# Altium project science-board-25.PrjPcb
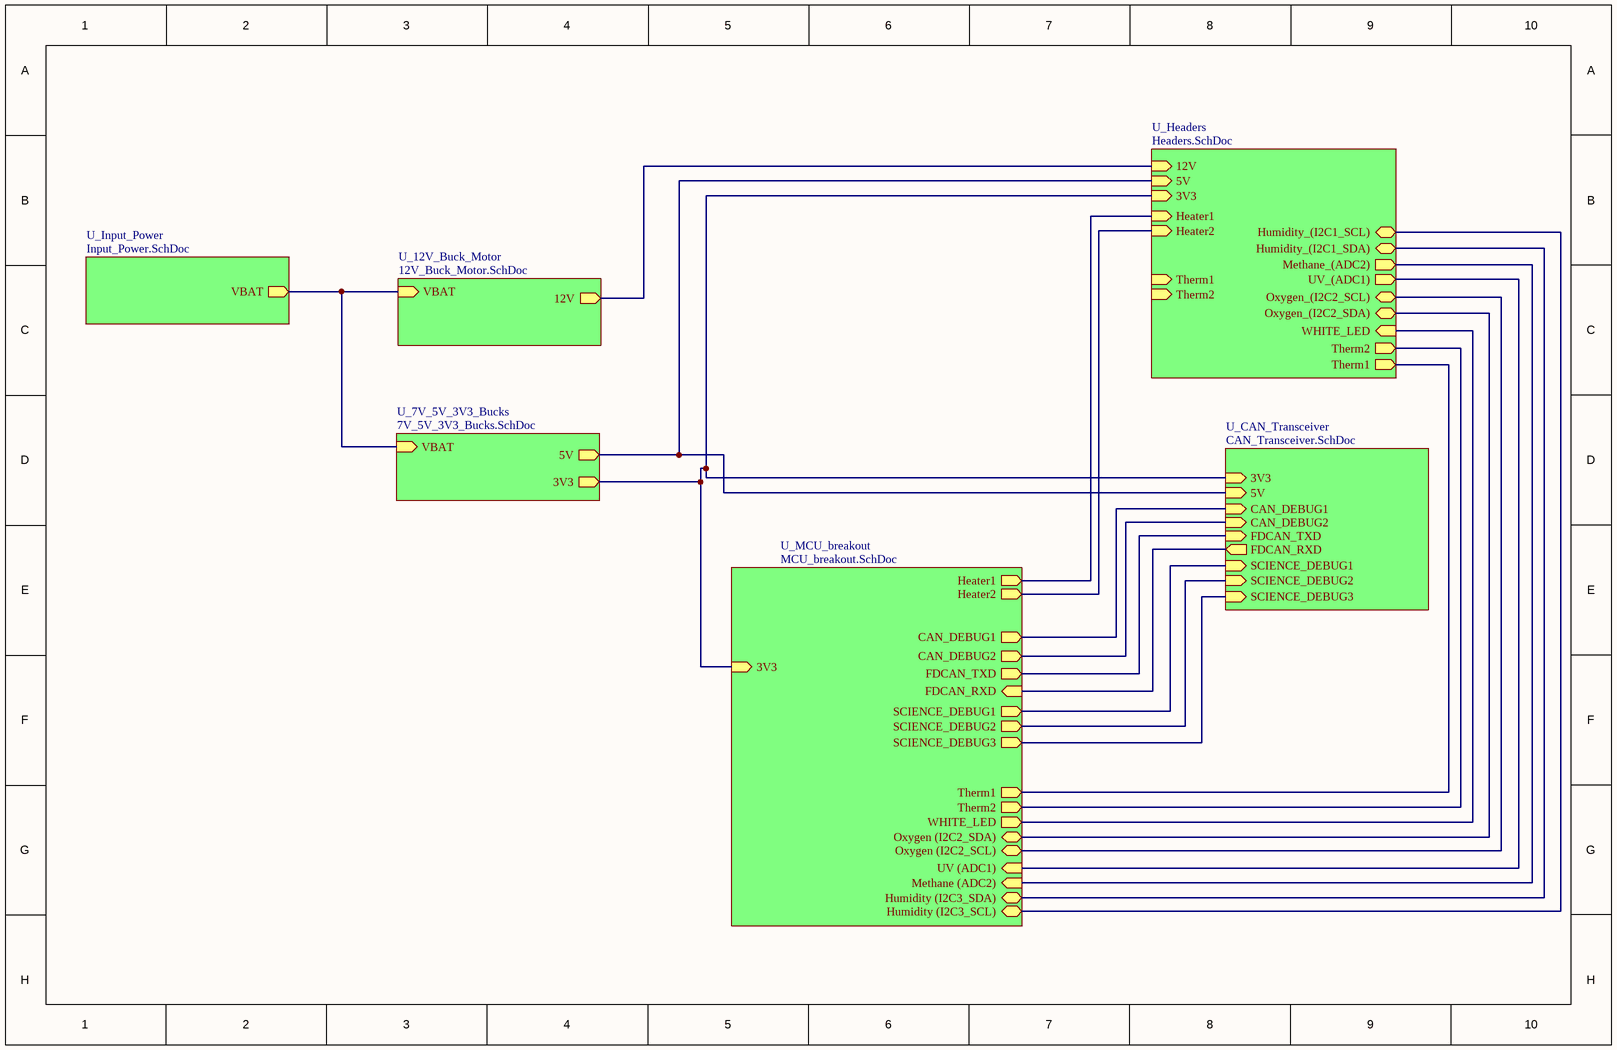
[diagram p0: TLD.SchDoc]
7 sheets, 135 parts. Net scope: hierarchical (ports join the sheet entries above them; power ports are global).
Board file: science_board_25.PcbDoc
Sheets:
  TLD.SchDoc
    U_12V_Buck_Motor = 12V_Buck_Motor.SchDoc
    U_CAN_Transceiver = CAN_Transceiver.SchDoc
    U_7V_5V_3V3_Bucks = 7V_5V_3V3_Bucks.SchDoc
    U_Headers = Headers.SchDoc
    U_MCU_breakout = MCU_breakout.SchDoc
    U_Input_Power = Input_Power.SchDoc

## Sheet TLD.SchDoc
size 302 x 195 mm; SheetNumber: 1; SheetTotal: 7

### Sub-sheets
U_7V_5V_3V3_Bucks = 7V_5V_3V3_Bucks.SchDoc: VBAT (in), 3V3 (out), 5V (out)
U_12V_Buck_Motor = 12V_Buck_Motor.SchDoc: 12V (out), VBAT (in)
U_CAN_Transceiver = CAN_Transceiver.SchDoc: CAN_DEBUG1 (in), CAN_DEBUG2 (in), FDCAN_TXD (in), FDCAN_RXD (out), 3V3 (in), 5V (in), SCIENCE_DEBUG1 (in), SCIENCE_DEBUG2 (in), SCIENCE_DEBUG3 (in)
U_Headers = Headers.SchDoc: Methane_(ADC2) (out), UV_(ADC1) (out), Heater1 (in), Heater2 (in), Therm1 (out), Therm2 (out), 12V (in), 5V (in), 3V3 (in), Therm1 (in), Therm2 (in), WHITE_LED (in), Humidity_(I2C1_SDA) (bidir), Humidity_(I2C1_SCL) (bidir), Oxygen_(I2C2_SCL) (bidir), Oxygen_(I2C2_SDA) (bidir)
U_Input_Power = Input_Power.SchDoc: VBAT (out)
U_MCU_breakout = MCU_breakout.SchDoc: Heater1 (out), Heater2 (out), Therm1 (out), Therm2 (out), CAN_DEBUG1 (out), CAN_DEBUG2 (out), FDCAN_TXD (out), FDCAN_RXD (in), 3V3 (in), Humidity (I2C3_SCL) (bidir), WHITE_LED (out), Oxygen (I2C2_SDA) (bidir), Oxygen (I2C2_SCL) (bidir), UV (ADC1) (in), Methane (ADC2) (in), Humidity (I2C3_SDA) (bidir), SCIENCE_DEBUG3 (out), SCIENCE_DEBUG1 (out), SCIENCE_DEBUG2 (out)

### Nets
3V3_OUT: sheet U_CAN_Transceiver/3V3, sheet U_7V_5V_3V3_Bucks/3V3, sheet U_Headers/3V3, sheet U_MCU_breakout/3V3
5V_OUT: sheet U_CAN_Transceiver/5V, sheet U_7V_5V_3V3_Bucks/5V, sheet U_Headers/5V
VBAT_12V: sheet U_12V_Buck_Motor/VBAT, sheet U_7V_5V_3V3_Bucks/VBAT, sheet U_Input_Power/VBAT
CAN_DEBUG1: sheet U_CAN_Transceiver/CAN_DEBUG1, sheet U_MCU_breakout/CAN_DEBUG1
CAN_DEBUG2: sheet U_CAN_Transceiver/CAN_DEBUG2, sheet U_MCU_breakout/CAN_DEBUG2
FDCAN_RXD: sheet U_CAN_Transceiver/FDCAN_RXD, sheet U_MCU_breakout/FDCAN_RXD
FDCAN_TXD: sheet U_CAN_Transceiver/FDCAN_TXD, sheet U_MCU_breakout/FDCAN_TXD
Heater1: sheet U_Headers/Heater1, sheet U_MCU_breakout/Heater1
Heater2: sheet U_Headers/Heater2, sheet U_MCU_breakout/Heater2
Humidity (I2C3_SCL): sheet U_Headers/Humidity_(I2C1_SCL), sheet U_MCU_breakout/Humidity (I2C3_SCL)
Humidity_SDA: sheet U_Headers/Humidity_(I2C1_SDA), sheet U_MCU_breakout/Humidity (I2C3_SDA)
Methane (ADC2): sheet U_Headers/Methane_(ADC2), sheet U_MCU_breakout/Methane (ADC2)
Oxygen (I2C2_SCL): sheet U_Headers/Oxygen_(I2C2_SCL), sheet U_MCU_breakout/Oxygen (I2C2_SCL)
Oxygen (I2C2_SDA): sheet U_Headers/Oxygen_(I2C2_SDA), sheet U_MCU_breakout/Oxygen (I2C2_SDA)
SCIENCE_DEBUG1: sheet U_CAN_Transceiver/SCIENCE_DEBUG1, sheet U_MCU_breakout/SCIENCE_DEBUG1
SCIENCE_DEBUG2: sheet U_CAN_Transceiver/SCIENCE_DEBUG2, sheet U_MCU_breakout/SCIENCE_DEBUG2
SCIENCE_DEBUG3: sheet U_CAN_Transceiver/SCIENCE_DEBUG3, sheet U_MCU_breakout/SCIENCE_DEBUG3
Therm1: sheet U_Headers/Therm1, sheet U_Headers/Therm1, sheet U_MCU_breakout/Therm1
Therm1: sheet U_Headers/Therm2, sheet U_Headers/Therm2, sheet U_MCU_breakout/Therm2  [a separate net that carries the same name]
UV (ADC1): sheet U_Headers/UV_(ADC1), sheet U_MCU_breakout/UV (ADC1)
WHITE_LED: sheet U_Headers/WHITE_LED, sheet U_MCU_breakout/WHITE_LED
(unnamed): sheet U_12V_Buck_Motor/12V, sheet U_Headers/12V

### Notes on the sheet
- DWG. NO.
- REV.
- SHT.
- REVISION
- DESCRIPTION
- DATE
- APPROVED
- THIS DOCUMENT AND THE DATA DISCLOSED HEREIN OR HEREWITH IS THE PROPERTY OF ALTIUM LIMITED AND MAY BE FREELY DISTRIBUTED IN WHOLE. NO RIGHTS ARE RESERVED OR EXPRESS OR IMPLIED WARANTEE GIVEN.
- ENG:
- DSN:
- APPROVALS
- PROJECT
- DOCUMENT REVISION:
- DESIGN ITEM:
- CHK:
- BOM:
- REFERENCE DOCUMENTS
- PROJECT REVISION:
- TITLE
- FAB DWG:
- PCB DWG:
- ASSY DWG:
- SCALE:
- SIZE
- C
- CAGE CODE
- FILE NAME
- DWG NO.
- SHEET
- OF
- REV

## Sheet 12V_Buck_Motor.SchDoc
size 259 x 167 mm; SheetNumber: 3; SheetTotal: 7
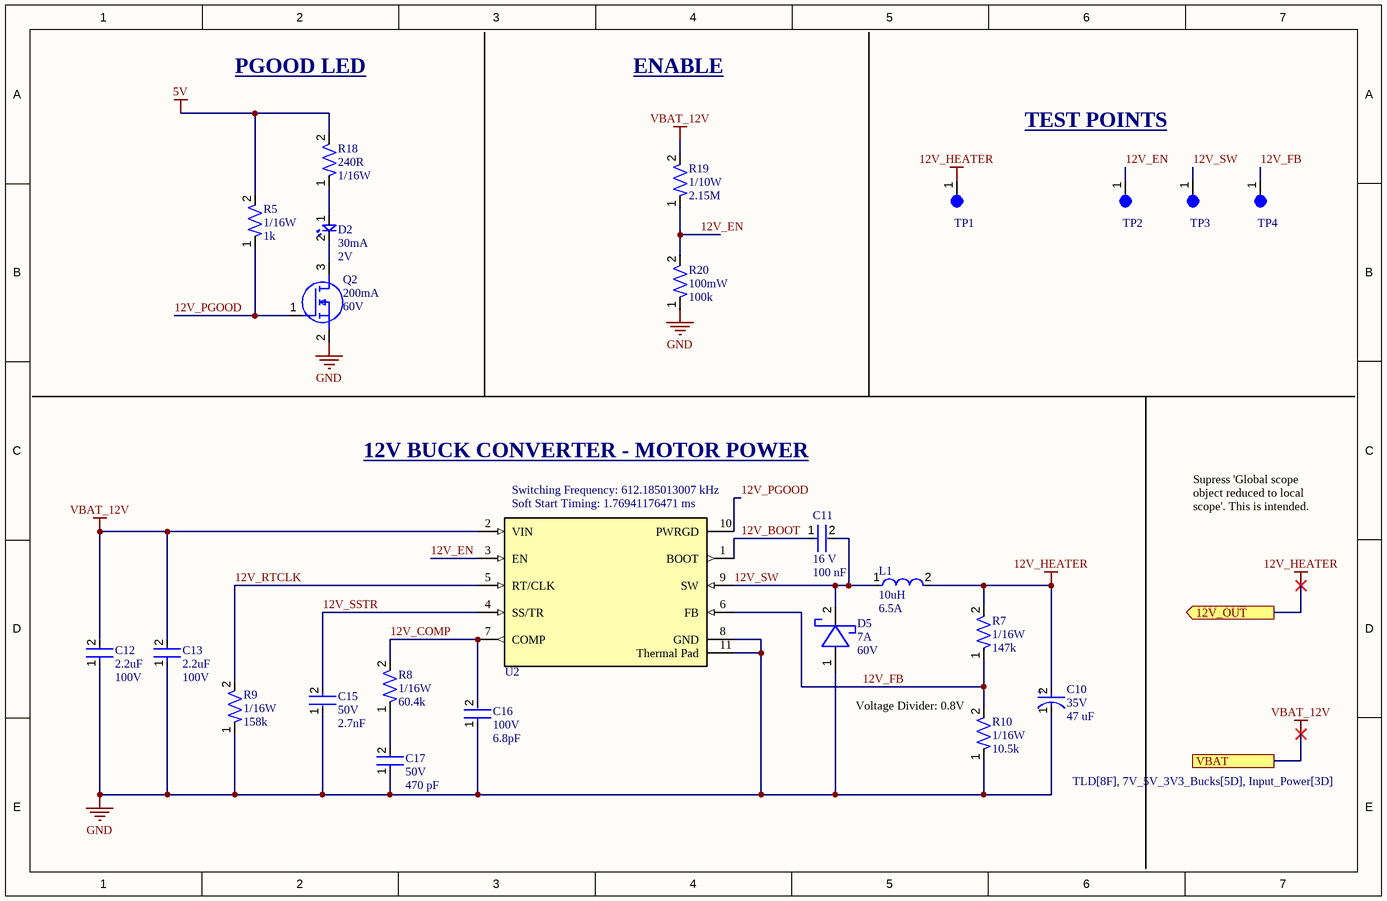
[diagram p1: 12V_Buck_Motor.SchDoc]

### Parts
C10  Voltage: 35V  Capacitance: 47 uF  [CAP-Radial-SMD]  (hidden comment: EEH-ZC1V470P)
C11  Voltage Rating: 16 V  Capacitance: 100 nF  [CAP-0402]  (hidden comment: CC0402KRX7R7BB104)
C12  Capacitance: 2.2uF  Voltage: 100V  [CAP-1206]  (hidden comment: CC1206KKX7R0BB225)
C13  Capacitance: 2.2uF  Voltage: 100V  [CAP-1206]  (hidden comment: CC1206KKX7R0BB225)
C15  Voltage: 50V  Capacitance: 2.7nF  [CAP-0805]  (hidden comment: GRM2165C1H272JA01D)
C16  Voltage: 100V  Capacitance: 6.8pF  [CAP-0603]  (hidden comment: CC0603CRNPO0BN6R8)
C17  Voltage: 50V  Capacitance: 470 pF  [CAP-0805]  (hidden comment: CC0805JRNPO9BN471)
D2  Forward Current: 30mA  Forward Voltage: 2V  [LED-0603]  (hidden comment: BL-HKC36G-AV-TRB)
D5  Forward Current: 7A  Reverse Voltage (DC): 60V  [DO-POWERDI5]  (hidden comment: PDS760-13)
L1  Inductance: 10uH  Current Rating: 6.5A  [IND-10UH-0001]  (hidden comment: BMRF001010401R0MD1)
Q2  Continuous Current: 200mA  Voltage: 60V  [IC-SOT23-3]  (hidden comment: T2N7002AK,LM)
R5  Power: 1/16W  Resistance: 1k  [RES-0402]  (hidden comment: RC0402FR-071KL)
R7  Power: 1/16W  Resistance: 147k  [RES-0402]  (hidden comment: RC0402FR-07147KL)
R8  Power: 1/16W  Resistance: 60.4k  [RES-0402]  (hidden comment: RC0402FR-0760K4L)
R9  Power: 1/16W  Resistance: 158k  [RES-0402]  (hidden comment: RC0402FR-07158KL)
R10  Power: 1/16W  Resistance: 10.5k  [RES-0402]  (hidden comment: RC0402FR-0710K5L)
R18  Resistance: 240R  Power: 1/16W  [RES-0402]  (hidden comment: RC0402FR-07240RL)
R19  Power: 1/10W  Resistance: 2.15M  [RES-0603]  (hidden comment: RC0603FR-072M15L)
R20  Power: 100mW  Resistance: 100k  [RES-0603]  (hidden comment: RC0603FR-07100KL)
TP1  5003  [TEST-POINT-0001]  (value not drawn)
TP2  5003  [TEST-POINT-0001]  (value not drawn)
TP3  5003  [TEST-POINT-0001]  (value not drawn)
TP4  5003  [TEST-POINT-0001]  (value not drawn)
U2  TPS54561DPRR  [IC-10WSON]  (value not drawn)

### Ports
12V_OUT (out), VBAT (see TLD[8F], 7V_5V_3V3_Bucks[5D], Input_Power[3D])

### Nets
5V: R5.2 R18.2  [project net 5V_OUT]
12V_HEATER: C10.2(A) L1.2 R7.2 TP1.1 ; port 12V_OUT
GND: C10.1(C) C12.1 C13.1 C15.1 C16.1 C17.1 D5.1(CATHODE) Q2.2(S) R9.1 R10.1 R20.1 U2.8(GND) U2.11(Thermal_Pad)
VBAT_12V: C12.2 C13.2 R19.2 U2.2(VIN) ; port VBAT
12V_BOOT: C11.1 U2.1(BOOT)
12V_COMP: C16.2 R8.2 U2.7(COMP)
12V_EN: R19.1 R20.2 TP2.1 U2.3(EN)
12V_FB: R7.1 R10.2 TP4.1 U2.6(FB)
12V_PGOOD: Q2.1(G) R5.1 U2.10(PWRGD)
12V_RTCLK: R9.2 U2.5(RT/CLK)
12V_SSTR: C15.2 U2.4(SS/TR)
12V_SW: C11.2 D5.2(ANODE) L1.1 TP3.1 U2.9(SW)
NetC17_2: C17.2 R8.1
NetD2_1: D2.1 R18.1
NetD2_2: D2.2 Q2.3(D)

### Notes on the sheet
- PGOOD LED
- ENABLE
- TEST POINTS
- 12V BUCK CONVERTER - MOTOR POWER
- (near U2) Switching Frequency: 612.185013007 kHz
- (near U2) Soft Start Timing: 1.76941176471 ms
- Supress 'Global scope object reduced to local scope'. This is intended.
- (near R10) Voltage Divider: 0.8V
- DWG. NO.
- REV.
- SHT.
- REVISION
- DESCRIPTION
- DATE
- APPROVED
- THIS DOCUMENT AND THE DATA DISCLOSED HEREIN OR HEREWITH IS THE PROPERTY OF ALTIUM LIMITED AND MAY BE FREELY DISTRIBUTED IN WHOLE. NO RIGHTS ARE RESERVED OR EXPRESS OR IMPLIED WARANTEE GIVEN.
- ENG:
- DSN:
- APPROVALS
- PROJECT
- DOCUMENT REVISION:
- DESIGN ITEM:
- CHK:
- BOM:
- REFERENCE DOCUMENTS
- PROJECT REVISION:
- TITLE
- FAB DWG:
- PCB DWG:
- ASSY DWG:
- SCALE:
- SIZE
- C
- CAGE CODE
- FILE NAME
- DWG NO.
- SHEET
- OF
- REV
- (in symbol CAP-47U-0002) +

### Library data of the parts
C10 = CAP-47U-0002: CAP ALUM HYBRID 47UF 20% 35V SMD; Device Class: Electrolytic; ComponentLink1Description: Datasheet; ComponentLink1URL: https://industrial.panasonic.com/cdbs/www-data/pdf/RDD0000/ABA0000C1234.pdf
C11 = CAP-0.1U-0001: CAP CER 0.1UF 16V X7R 0402; ComponentLink2Description: Datasheet; ComponentLink2URL: https://www.yageo.com/upload/media/product/productsearch/datasheet/mlcc/UPY-GPHC_X7R_6.3V-to-250V_24.pdf; Device Class: Ceramic; Size: 0402
C12 C13 = CAP-2.2U-0001: CAP CER 2.2UF 100V X7R 1206; Device Class: Ceramic; Size: 1206; ComponentLink1Description: Datasheet; ComponentLink1URL: https://www.yageo.com/upload/media/product/productsearch/datasheet/mlcc/UPY-GPHC_X7R_6.3V-to-250V_24.pdf
C15 = CAP-2.7N-0001: CAP CER 2700PF 50V C0G/NP0 0805; ComponentLink1Description: Datasheet; ComponentLink1URL: https://search.murata.co.jp/Ceramy/image/img/A01X/G101/ENG/GRM2165C1H272JA01-01.pdf; Device Class: Ceramic; Size: 0805
C16 = CAP-6.8P-0001: CAP CER 6.8PF 100V C0G/NPO 0603; Device Class: Ceramic; ComponentLink1Description: Datasheet; ComponentLink1URL: https://www.yageo.com/upload/media/product/productsearch/datasheet/mlcc/UPY-GPHC_X7R_6.3V-to-250V_24.pdf; Size: 0603
C17 = CAP-470P-0001: CAP CER 470PF 50V C0G/NPO 0805; Device Class: Ceramic; Size: 0805; ComponentLink1Description: Datasheet; ComponentLink1URL: https://www.yageo.com/upload/media/product/productsearch/datasheet/mlcc/UPY-GP_NP0_16V-to-50V_18.pdf
D2 = LED-0001: LED YELLOW CLEAR 0603 SMD; ComponentLink1Description: Datasheet; ComponentLink1URL: https://www.americanbrightled.com/pdffiles/led-components/smt/BL-HKC36G-AV-TRB.pdf
D5 = DIO-SCHOTTKY-0001: DIODE SCHOTTKY 60V 7A POWERDI5; ComponentLink1Description: Datasheet; ComponentLink1URL: https://www.diodes.com/assets/Datasheets/PDS760.pdf
L1 = IND-10U-0001: FIXED IND 10UH 6.5A 30 MOHM SMD; ComponentLink1Description: Datasheet; ComponentLink1URL: https://productfinder.pulseelectronics.com/api/open/part-attachments/datasheet/BMRF001010401R0MD1
Q2 = NMOS-200MA-0001: MOSFET N-CH 60V 200MA SOT23; ComponentLink1Description: Datasheet; ComponentLink1URL: https://toshiba.semicon-storage.com/info/T2N7002AK_datasheet_en_20150401.pdf?did=29712&prodName=T2N7002AK
R5 = RES-1k-0001: RES 1K OHM 1% 1/16W 0402; Tolerance: 1%; Size: 0402; ComponentLink1Description: Datasheet; ComponentLink1URL: https://www.yageo.com/upload/media/product/products/datasheet/rchip/PYu-RC_Group_51_RoHS_L_12.pdf
R7 = RES-147k-0001: RES 147K OHM 1% 1/16W 0402; Tolerance: 1%; Size: 0402; ComponentLink1Description: Datasheet; ComponentLink1URL: https://www.yageo.com/upload/media/product/products/datasheet/rchip/PYu-RC_Group_51_RoHS_L_12.pdf
R8 = RES-60.4k-0001: RES 60.4K OHM 1% 1/16W 0402; Tolerance: 1%; Size: 0402; ComponentLink1Description: Datasheet; ComponentLink1URL: https://www.yageo.com/upload/media/product/products/datasheet/rchip/PYu-RC_Group_51_RoHS_L_12.pdf
R9 = RES-158k-0001: RES 158K OHM 1% 1/16W 0402; Tolerance: 1%; Size: 0402; ComponentLink1Description: Datasheet; ComponentLink1URL: https://www.yageo.com/upload/media/product/products/datasheet/rchip/PYu-RC_Group_51_RoHS_L_12.pdf
R10 = RES-10.5k-0001: RES 10.5K OHM 1% 1/16W 0402; Tolerance: 1%; Size: 0402; ComponentLink1Description: Datasheet; ComponentLink1URL: https://www.yageo.com/upload/media/product/products/datasheet/rchip/PYu-RC_Group_51_RoHS_L_12.pdf
R18 = RES-240-0001: 240R 0.063W 1% 0402 (1005 Metric)  SMD; Tolerance: 1%; Size: 0402; ComponentLink1Description: Datasheet; ComponentLink1URL: https://www.yageo.com/upload/media/product/products/datasheet/rchip/PYu-RC_Group_51_RoHS_L_12.pdf
R19 = RES-2.15M-0001: RES SMD 2.15M OHM 1% 1/10W 0603; Tolerance: 1%; Size: 0603; ComponentLink1Description: Datasheet; ComponentLink1URL: https://www.yageo.com/upload/media/product/products/datasheet/rchip/PYu-RC_Group_51_RoHS_L_12.pdf
R20 = RES-100k-0001: RES SMD 100K OHM 1% 1/10W 0603; Tolerance: 1%; Size: 0603; ComponentLink1Description: Datasheet; ComponentLink1URL: https://www.yageo.com/upload/media/product/products/datasheet/rchip/PYu-RC_Group_51_RoHS_L_12.pdf
TP1-TP4 = TEST-POINT-0001: Oranange PC Test Point, Miniature Phoisphor Bronze Silver Plating Through Hole Mounting Type
U2 = IC-BUCK-0001: IC REG BUCK ADJ 5A 10WSON; ComponentLink1Description: Datasheet; ComponentLink1URL: https://www.ti.com/general/docs/suppproductinfo.tsp?distId=10&gotoUrl=https%3A%2F%2Fwww.ti.com%2Flit%2Fgpn%2Ftps54561

## Sheet CAN_Transceiver.SchDoc
size 259 x 167 mm; SheetNumber: 5; SheetTotal: 7
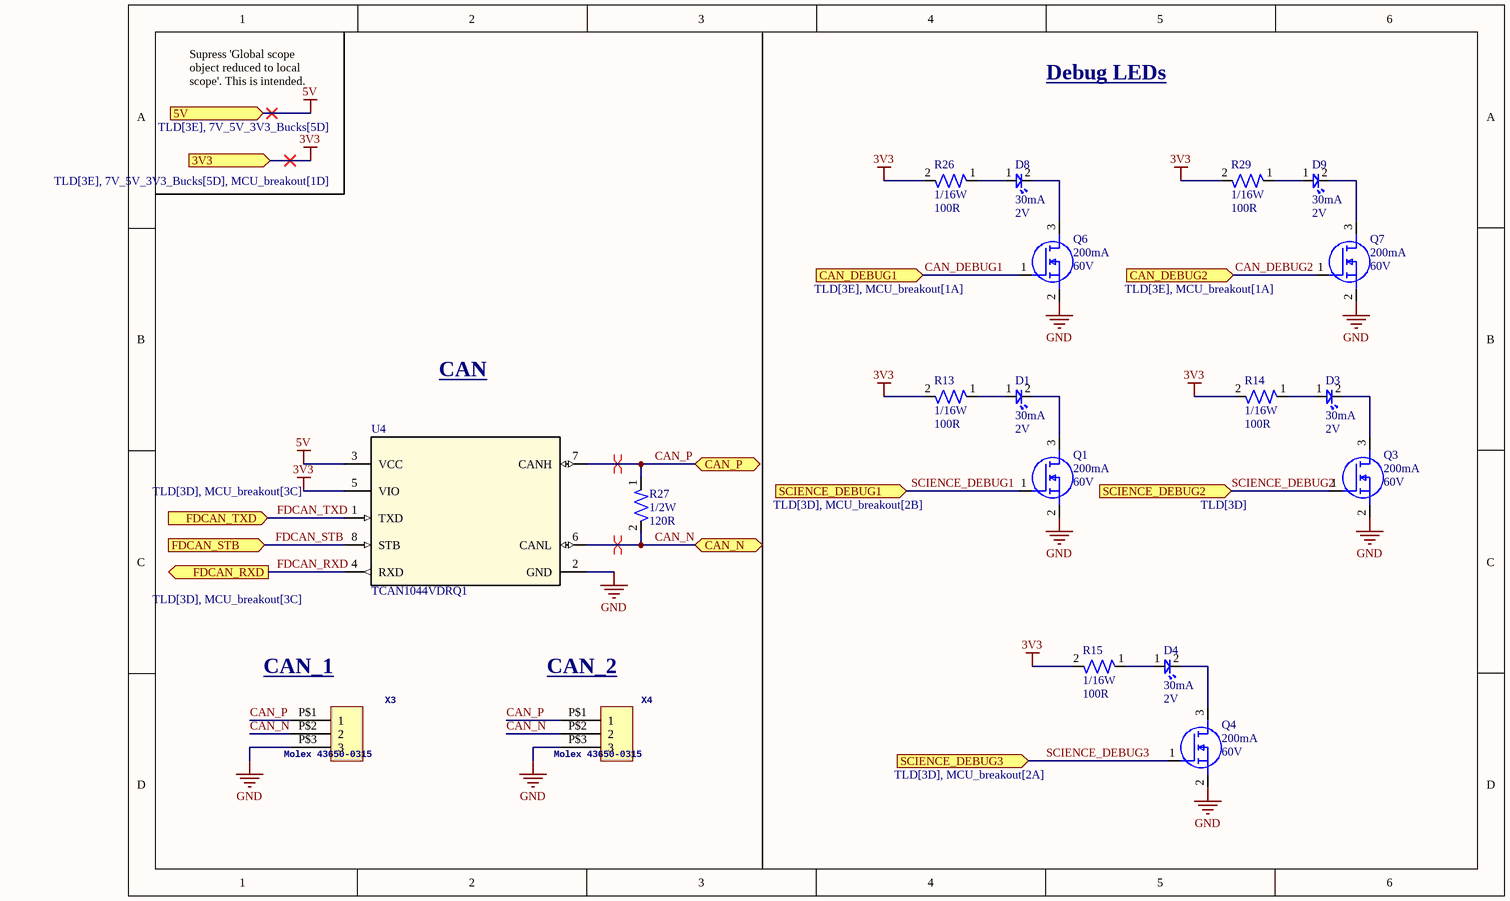
[diagram p2: CAN_Transceiver.SchDoc]

### Parts
D1  Forward Current: 30mA  Forward Voltage: 2V  [LED-0603]  (hidden comment: BL-HKC36G-AV-TRB)
D3  Forward Current: 30mA  Forward Voltage: 2V  [LED-0603]  (hidden comment: BL-HKC36G-AV-TRB)
D4  Forward Current: 30mA  Forward Voltage: 2V  [LED-0603]  (hidden comment: BL-HKC36G-AV-TRB)
D8  Forward Current: 30mA  Forward Voltage: 2V  [LED-0603]  (hidden comment: BL-HKC36G-AV-TRB)
D9  Forward Current: 30mA  Forward Voltage: 2V  [LED-0603]  (hidden comment: BL-HKC36G-AV-TRB)
Q1  Continuous Current: 200mA  Voltage: 60V  [IC-SOT23-3]  (hidden comment: T2N7002AK,LM)
Q3  Continuous Current: 200mA  Voltage: 60V  [IC-SOT23-3]  (hidden comment: T2N7002AK,LM)
Q4  Continuous Current: 200mA  Voltage: 60V  [IC-SOT23-3]  (hidden comment: T2N7002AK,LM)
Q6  Continuous Current: 200mA  Voltage: 60V  [IC-SOT23-3]  (hidden comment: T2N7002AK,LM)
Q7  Continuous Current: 200mA  Voltage: 60V  [IC-SOT23-3]  (hidden comment: T2N7002AK,LM)
R13  Power: 1/16W  Resistance: 100R  [RES-0402]  (hidden comment: RC0402FR-07100RL)
R14  Power: 1/16W  Resistance: 100R  [RES-0402]  (hidden comment: RC0402FR-07100RL)
R15  Power: 1/16W  Resistance: 100R  [RES-0402]  (hidden comment: RC0402FR-07100RL)
R26  Power: 1/16W  Resistance: 100R  [RES-0402]  (hidden comment: RC0402FR-07100RL)
R27  Power: 1/2W  Resistance: 120R  [RES-1210]  (hidden comment: RC1210FR-07120RL)
R29  Power: 1/16W  Resistance: 100R  [RES-0402]  (hidden comment: RC0402FR-07100RL)
U4  TCAN1044VDRQ1  [IC-8SOIC]
X3  Molex 43650-0315  [43650-0315]
X4  Molex 43650-0315  [43650-0315]

### Ports
3V3 (in, see TLD[3E], 7V_5V_3V3_Bucks[5D], MCU_breakout[1D]), 5V (in, see TLD[3E], 7V_5V_3V3_Bucks[5D]), CAN_DEBUG1 (in, see TLD[3E], MCU_breakout[1A]), CAN_DEBUG2 (in, see TLD[3E], MCU_breakout[1A]), CAN_N (bidir), CAN_P (bidir), FDCAN_RXD (out, see TLD[3D], MCU_breakout[3C]), FDCAN_STB (in), FDCAN_TXD (in, see TLD[3D], MCU_breakout[3C]), SCIENCE_DEBUG1 (in, see TLD[3D], MCU_breakout[2B]), SCIENCE_DEBUG2 (in, see TLD[3D]), SCIENCE_DEBUG3 (in, see TLD[3D], MCU_breakout[2A])

### Nets
3V3: R13.2 R14.2 R15.2 R26.2 R29.2 U4.5(VIO) ; port 3V3  [project net 3V3_OUT]
5V: U4.3(VCC) ; port 5V  [project net 5V_OUT]
GND: Q1.2(S) Q3.2(S) Q4.2(S) Q6.2(S) Q7.2(S) U4.2(GND) X3.P$3(3) X4.P$3(3)
CAN_DEBUG1: Q6.1(G) ; port CAN_DEBUG1
CAN_DEBUG2: Q7.1(G) ; port CAN_DEBUG2
CAN_N: R27.2 U4.6(CANL) X3.P$2(2) X4.P$2(2) ; port CAN_N
CAN_P: R27.1 U4.7(CANH) X3.P$1(1) X4.P$1(1) ; port CAN_P
FDCAN_RXD: U4.4(RXD) ; port FDCAN_RXD
FDCAN_STB: U4.8(STB) ; port FDCAN_STB
FDCAN_TXD: U4.1(TXD) ; port FDCAN_TXD
SCIENCE_DEBUG1: Q1.1(G) ; port SCIENCE_DEBUG1
SCIENCE_DEBUG2: Q3.1(G) ; port SCIENCE_DEBUG2
SCIENCE_DEBUG3: Q4.1(G) ; port SCIENCE_DEBUG3
NetD1_1: D1.1 R13.1
NetD1_2: D1.2 Q1.3(D)
NetD3_1: D3.1 R14.1
NetD3_2: D3.2 Q3.3(D)
NetD4_1: D4.1 R15.1
NetD4_2: D4.2 Q4.3(D)
NetD8_1: D8.1 R26.1
NetD8_2: D8.2 Q6.3(D)
NetD9_1: D9.1 R29.1
NetD9_2: D9.2 Q7.3(D)

### Layout directives
differential pair: CAN_N, CAN_P

### Notes on the sheet
- Supress 'Global scope object reduced to local scope'. This is intended.
- Debug LEDs
- CAN
- (near X3) CAN_1
- (near X4) CAN_2

### Library data of the parts
D1 D3 D4 D8 D9 = LED-0001: LED YELLOW CLEAR 0603 SMD; ComponentLink1Description: Datasheet; ComponentLink1URL: https://www.americanbrightled.com/pdffiles/led-components/smt/BL-HKC36G-AV-TRB.pdf
Q1 Q3 Q4 Q6 Q7 = NMOS-200MA-0001: MOSFET N-CH 60V 200MA SOT23; ComponentLink1Description: Datasheet; ComponentLink1URL: https://toshiba.semicon-storage.com/info/T2N7002AK_datasheet_en_20150401.pdf?did=29712&prodName=T2N7002AK
R13-R15 R26 R29 = RES-100-0001: RES 100 OHM 1% 1/16W 0402; Tolerance: 1%; Size: 0402; ComponentLink1Description: Datasheet; ComponentLink1URL: https://www.yageo.com/upload/media/product/products/datasheet/rchip/PYu-RC_Group_51_RoHS_L_12.pdf
R27 = RES-120-0001: RES 120 OHM 1% 1/2W 1210; Tolerance: 1%; Size: 1210; ComponentLink1Description: Datasheet; ComponentLink1URL: https://www.yageo.com/upload/media/product/products/datasheet/rchip/PYu-RC_Group_51_RoHS_L_12.pdf
U4 = IC-CAN-0001: IC TRANSCEIVER 1/1 8SOIC; ComponentLink1Description: Datasheet; ComponentLink1URL: https://www.ti.com/lit/ds/symlink/tcan1044-q1.pdf?HQS=dis-dk-null-digikeymode-dsf-pf-null-wwe&ts=1728758303289&ref_url=https%253A%252F%252Fwww.ti.com%252Fgeneral%252Fdocs%252Fsuppproductinfo.tsp%253FdistId%253D10%2526gotoUrl%253Dhttps%253A%252F%252Fwww.ti.com%252Flit%252Fgpn%252Ftcan1044-q1
X3 X4 = Micro-Fit Molex 3 Pin Vertical: GateName_1: G$1; SymbolName_1: HEADER_POS3; DeviceSetName: HEADER_POS3_?; DeviceName: 43650-0315; LibraryName: con-molex-micro-fit-3_0_2; Package: 43650-0315

## Sheet 7V_5V_3V3_Bucks.SchDoc
size 259 x 167 mm; SheetNumber: 4; SheetTotal: 7
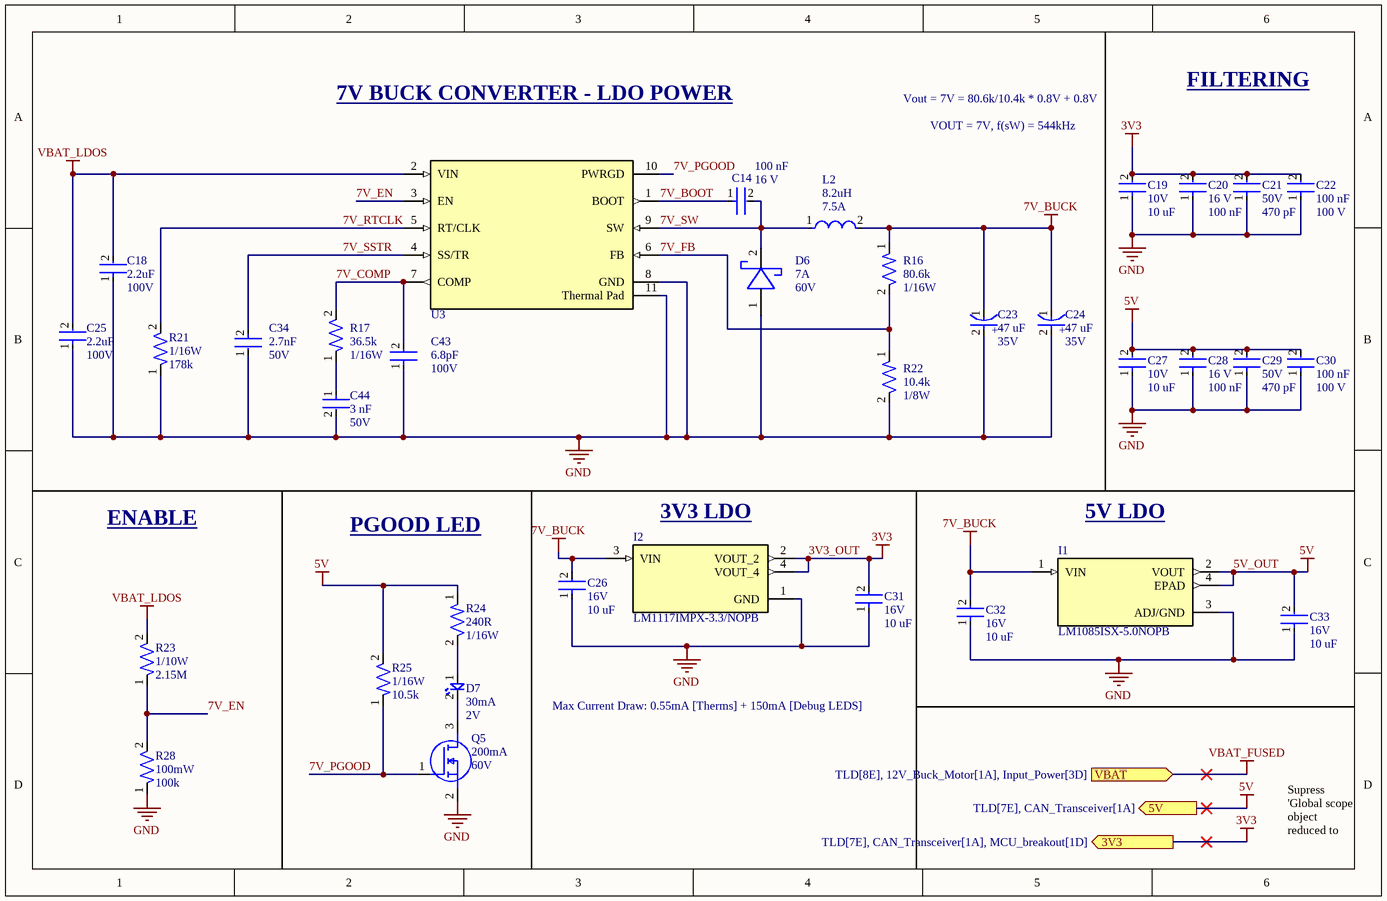
[diagram p3: 7V_5V_3V3_Bucks.SchDoc]

### Parts
C14  Voltage Rating: 16 V  Capacitance: 100 nF  [CAP-0402]  (hidden comment: CC0402KRX7R7BB104)
C18  Capacitance: 2.2uF  Voltage: 100V  [CAP-1206]  (hidden comment: CC1206KKX7R0BB225)
C19  Voltage: 10V  Capacitance: 10 uF  [CAP-0603]  (hidden comment: CC0603KRX5R6BB106)
C20  Voltage Rating: 16 V  Capacitance: 100 nF  [CAP-0402]  (hidden comment: CC0402KRX7R7BB104)
C21  Voltage: 50V  Capacitance: 470 pF  [CAP-0805]  (hidden comment: CC0805JRNPO9BN471)
C22  Capacitance: 100 nF  Voltage: 100 V  [CAP-0603]  (hidden comment: CC0603KRX7R0BB104)
C23  Capacitance: 47 uF  Voltage: 35V  [CAP-Radial-SMD]  (hidden comment: EEH-ZC1V470P)
C24  Capacitance: 47 uF  Voltage: 35V  [CAP-Radial-SMD]  (hidden comment: EEH-ZC1V470P)
C25  Capacitance: 2.2uF  Voltage: 100V  [CAP-1206]  (hidden comment: CC1206KKX7R0BB225)
C26  Voltage: 16V  Capacitance: 10 uF  [CAP-1210]  (hidden comment: 293D106X9016A2TE3)
C27  Voltage: 10V  Capacitance: 10 uF  [CAP-0603]  (hidden comment: CC0603KRX5R6BB106)
C28  Voltage Rating: 16 V  Capacitance: 100 nF  [CAP-0402]  (hidden comment: CC0402KRX7R7BB104)
C29  Voltage: 50V  Capacitance: 470 pF  [CAP-0805]  (hidden comment: CC0805JRNPO9BN471)
C30  Capacitance: 100 nF  Voltage: 100 V  [CAP-0603]  (hidden comment: CC0603KRX7R0BB104)
C31  Voltage: 16V  Capacitance: 10 uF  [CAP-1210]  (hidden comment: 293D106X9016A2TE3)
C32  Voltage: 16V  Capacitance: 10 uF  [CAP-1210]  (hidden comment: 293D106X9016A2TE3)
C33  Voltage: 16V  Capacitance: 10 uF  [CAP-1210]  (hidden comment: 293D106X9016A2TE3)
C34  Voltage: 50V  Capacitance: 2.7nF  [CAP-0805]  (hidden comment: GRM2165C1H272JA01D)
C43  Voltage: 100V  Capacitance: 6.8pF  [CAP-0603]  (hidden comment: CC0603CRNPO0BN6R8)
C44  Voltage: 50V  Capacitance: 3 nF  [CAP-0603]  (hidden comment: GRM1885C1H302JA01D)
D6  Forward Current: 7A  Reverse Voltage (DC): 60V  [DO-POWERDI5]  (hidden comment: PDS760-13)
D7  Forward Current: 30mA  Forward Voltage: 2V  [LED-0603]  (hidden comment: BL-HKC36G-AV-TRB)
I1  LM1085ISX-5.0NOPB  [IC-TO-263-4]
I2  LM1117IMPX-3.3/NOPB  [IC-SOT-223-4]
L2  Inductance: 8.2uH  Current Rating: 7.5A  [IND25X25CZ]  (hidden comment: IHLP2525CZER8R2M01)
Q5  Continuous Current: 200mA  Voltage: 60V  [IC-SOT23-3]  (hidden comment: T2N7002AK,LM)
R16  Resistance: 80.6k  Power: 1/16W  [RES-0402]  (hidden comment: RC0402FR-0780K6L)
R17  Power: 1/16W  Resistance: 36.5k  [RES-0402]  (hidden comment: RC0402FR-0736K5L)
R21  Power: 1/16W  Resistance: 178k  [RES-0402]  (hidden comment: RTT021783FTH)
R22  Power: 1/8W  Resistance: 10.4k  [RES-0805]  (hidden comment: RT0805BRD0710K4L)
R23  Power: 1/10W  Resistance: 2.15M  [RES-0603]  (hidden comment: RC0603FR-072M15L)
R24  Resistance: 240R  Power: 1/16W  [RES-0402]  (hidden comment: RC0402FR-07240RL)
R25  Power: 1/16W  Resistance: 10.5k  [RES-0402]  (hidden comment: RC0402FR-0710K5L)
R28  Power: 100mW  Resistance: 100k  [RES-0603]  (hidden comment: RC0603FR-07100KL)
U3  TPS54561DPRR  [IC-10WSON]  (value not drawn)

### Ports
3V3 (out, see TLD[7E], CAN_Transceiver[1A], MCU_breakout[1D]), 5V (out, see TLD[7E], CAN_Transceiver[1A]), VBAT (in, see TLD[8E], 12V_Buck_Motor[1A], Input_Power[3D])

### Nets
3V3_OUT: C19.2 C20.2 C21.2 C22.2 C31.2 I2.2(VOUT_2) I2.4(VOUT_4) ; port 3V3  [also labelled 3V3]
5V_OUT: C27.2 C28.2 C29.2 C30.2 C33.2 I1.2(VOUT) I1.4(EPAD) R24.1 R25.2 ; port 5V  [also labelled 5V]
7V_BUCK: C23.1(C) C24.1(C) C26.2 C32.2 I1.1(VIN) I2.3(VIN) L2.2 R16.1
GND: C18.1 C19.1 C20.1 C21.1 C22.1 C23.2(A) C24.2(A) C25.1 C26.1 C27.1 C28.1 C29.1 C30.1 C31.1 C32.1 C33.1 C34.1 C43.1 C44.2 D6.1(CATHODE) I1.3(ADJ/GND) I2.1(GND) Q5.2(S) R21.1 R22.2 R28.1 U3.8(GND) U3.11(Thermal_Pad)
VBAT_FUSED: C18.2 C25.2 R23.2 U3.2(VIN) ; port VBAT  [also labelled VBAT_LDOS]  [project net VBAT_12V]
7V_BOOT: C14.1 U3.1(BOOT)
7V_COMP: C43.2 R17.2 U3.7(COMP)
7V_EN: R23.1 R28.2 U3.3(EN)
7V_FB: R16.2 R22.1 U3.6(FB)
7V_PGOOD: Q5.1(G) R25.1 U3.10(PWRGD)
7V_RTCLK: R21.2 U3.5(RT/CLK)
7V_SSTR: C34.2 U3.4(SS/TR)
7V_SW: C14.2 D6.2(ANODE) L2.1 U3.9(SW)
NetC44_1: C44.1 R17.1
NetD7_1: D7.1 R24.2
NetD7_2: D7.2 Q5.3(D)

### Notes on the sheet
- 7V BUCK CONVERTER - LDO POWER
- Vout = 7V = 80.6k/10.4k * 0.8V + 0.8V
- FILTERING
- VOUT = 7V, f(sW) = 544kHz
- (near I2) 3V3 LDO
- (near I1) 5V LDO
- ENABLE
- PGOOD LED
- Max Current Draw: 0.55mA [Therms] + 150mA [Debug LEDS]
- Supress 'Global scope object reduced to local scope'. This is intended.
- (in symbol CAP-47U-0002) +

### Library data of the parts
C14 C20 C28 = CAP-0.1U-0001: CAP CER 0.1UF 16V X7R 0402; ComponentLink2Description: Datasheet; ComponentLink2URL: https://www.yageo.com/upload/media/product/productsearch/datasheet/mlcc/UPY-GPHC_X7R_6.3V-to-250V_24.pdf; Device Class: Ceramic; Size: 0402
C18 C25 = CAP-2.2U-0001: CAP CER 2.2UF 100V X7R 1206; Device Class: Ceramic; Size: 1206; ComponentLink1Description: Datasheet; ComponentLink1URL: https://www.yageo.com/upload/media/product/productsearch/datasheet/mlcc/UPY-GPHC_X7R_6.3V-to-250V_24.pdf
C19 C27 = CAP-10U-0001: CAP CER 10UF 10V X5R 0603; ComponentLink1Description: Datasheet; ComponentLink1URL: https://www.yageo.com/upload/media/product/app/datasheet/mlcc/upy-gphc_x5r_4v-to-50v.pdf; Device Class: Ceramic; Size: 0603
C21 C29 = CAP-470P-0001: CAP CER 470PF 50V C0G/NPO 0805; Device Class: Ceramic; Size: 0805; ComponentLink1Description: Datasheet; ComponentLink1URL: https://www.yageo.com/upload/media/product/productsearch/datasheet/mlcc/UPY-GP_NP0_16V-to-50V_18.pdf
C22 C30 = CAP-100N-0001: CAP CER 0.1UF 100V X7R 0603; Device Class: Ceramic; Size: 0603; ComponentLink1Description: Datasheet; ComponentLink1URL: https://www.yageo.com/upload/media/product/app/datasheet/mlcc/upy-np0x7r_mv_100-to-630v.pdf
C23 C24 = CAP-47U-0002: CAP ALUM HYBRID 47UF 20% 35V SMD; Device Class: Electrolytic; ComponentLink1Description: Datasheet; ComponentLink1URL: https://industrial.panasonic.com/cdbs/www-data/pdf/RDD0000/ABA0000C1234.pdf
C26 C31-C33 = CAP-10U-0003_1: CAP TANT 10UF 10% 16V 1206; Device Class: Tantalum; Size: 1206; ComponentLink1Description: Datasheet; ComponentLink1URL: https://www.lcsc.com/datasheet/lcsc_datasheet_2304140030_Vishay-Intertech-293D106X9016A2TE3_C110038.pdf
C34 = CAP-2.7N-0001: CAP CER 2700PF 50V C0G/NP0 0805; ComponentLink1Description: Datasheet; ComponentLink1URL: https://search.murata.co.jp/Ceramy/image/img/A01X/G101/ENG/GRM2165C1H272JA01-01.pdf; Device Class: Ceramic; Size: 0805
C43 = CAP-6.8P-0001: CAP CER 6.8PF 100V C0G/NPO 0603; Device Class: Ceramic; ComponentLink1Description: Datasheet; ComponentLink1URL: https://www.yageo.com/upload/media/product/productsearch/datasheet/mlcc/UPY-GPHC_X7R_6.3V-to-250V_24.pdf; Size: 0603
C44 = CAP-3N-0001: 3000 pF ±5% 50V Ceramic Capacitor C0G, NP0 0603 (1608 Metric); Device Class: Ceramic; Size: 1210; ComponentLink1Description: Datasheet; ComponentLink1URL: https://mm.digikey.com/Volume0/opasdata/d220001/medias/docus/41/CL32B106KBJNNNE_Spec.pdf
D6 = DIO-SCHOTTKY-0001: DIODE SCHOTTKY 60V 7A POWERDI5; ComponentLink1Description: Datasheet; ComponentLink1URL: https://www.diodes.com/assets/Datasheets/PDS760.pdf
D7 = LED-0001: LED YELLOW CLEAR 0603 SMD; ComponentLink1Description: Datasheet; ComponentLink1URL: https://www.americanbrightled.com/pdffiles/led-components/smt/BL-HKC36G-AV-TRB.pdf
I1 = IC_LDO_5V_0002: IC REG LIN 5V 3A DDPAK/TO263-3; Mfr_Name: Texas Instruments; RefDes: RefDes; Type: Type; ComponentLink1Description: Datasheet; ComponentLink1URL: https://www.ti.com/lit/ds/symlink/lm1085.pdf?HQS=dis-dk-null-digikeymode-dsf-pf-null-wwe&ts=1729859809163&ref_url=https%253A%252F%252Fwww.ti.com%252Fgeneral%252Fdocs%252Fsuppproductinfo.tsp%253FdistId%253D10%2526gotoUrl%253Dhttps%253A%252F%252Fwww.ti.com%252Flit%252Fgpn%252Flm1085
I2 = IC_LDO_3V3_0001: IC REG LIN 3.3V 800MA SOT223-4; ComponentLink1Description: New link; ComponentLink1URL: https://www.ti.com/lit/ds/symlink/lm1117.pdf?HQS=dis-dk-null-digikeymode-dsf-pf-null-wwe&ts=1721700739746
L2 = IND-8.2U-0001: 8.2 µH Shielded Molded Inductor 4 A 68mOhm Max Nonstandard; ComponentLink1Description: Datasheet; ComponentLink1URL: https://products.sumida.com/products/pdf/CDRH104.pdf
Q5 = NMOS-200MA-0001: MOSFET N-CH 60V 200MA SOT23; ComponentLink1Description: Datasheet; ComponentLink1URL: https://toshiba.semicon-storage.com/info/T2N7002AK_datasheet_en_20150401.pdf?did=29712&prodName=T2N7002AK
R16 = RES-80.6k-0001: 80.6 kOhms ±1% 0.063W, 1/16W Chip Resistor 0402 (1005 Metric) Moisture Resistant Thick Film; Tolerance: 1%; Size: 0402; ComponentLink1Description: Datasheet; ComponentLink1URL: https://www.yageo.com/upload/media/product/products/datasheet/rchip/PYu-RC_Group_51_RoHS_L_12.pdf
R17 = RES-36.5k-0001: 36.5 kOhms ±1% 0.063W, 1/16W Chip Resistor 0402 (1005 Metric) Moisture Resistant Thick Film; Parameter 1: *
R21 = RES-178k-0001_1: 62.5mW Thick Film Resistors 50V ±100ppm/℃ ±1% 178kΩ 0402 Chip Resistor - Surface Mount ROHS; Tolerance: 1%; Size: 0402; ComponentLink1Description: Datasheet; ComponentLink1URL: https://www.lcsc.com/datasheet/lcsc_datasheet_2304140030_RALEC-RTT021783FTH_C102842.pdf
R22 = RES-10.4k-0001: 10.4 kOhms ±0.1% 0.125W, 1/8W Chip Resistor 0805 (2012 Metric) Thin Film; Tolerance: 1%; Size: 0402; ComponentLink1Description: Datasheet; ComponentLink1URL: https://www.yageo.com/upload/media/product/products/datasheet/rchip/PYu-RC_Group_51_RoHS_L_12.pdf
R23 = RES-2.15M-0001: RES SMD 2.15M OHM 1% 1/10W 0603; Tolerance: 1%; Size: 0603; ComponentLink1Description: Datasheet; ComponentLink1URL: https://www.yageo.com/upload/media/product/products/datasheet/rchip/PYu-RC_Group_51_RoHS_L_12.pdf
R24 = RES-240-0001: 240R 0.063W 1% 0402 (1005 Metric)  SMD; Tolerance: 1%; Size: 0402; ComponentLink1Description: Datasheet; ComponentLink1URL: https://www.yageo.com/upload/media/product/products/datasheet/rchip/PYu-RC_Group_51_RoHS_L_12.pdf
R25 = RES-10.5k-0001: RES 10.5K OHM 1% 1/16W 0402; Tolerance: 1%; Size: 0402; ComponentLink1Description: Datasheet; ComponentLink1URL: https://www.yageo.com/upload/media/product/products/datasheet/rchip/PYu-RC_Group_51_RoHS_L_12.pdf
R28 = RES-100k-0001: RES SMD 100K OHM 1% 1/10W 0603; Tolerance: 1%; Size: 0603; ComponentLink1Description: Datasheet; ComponentLink1URL: https://www.yageo.com/upload/media/product/products/datasheet/rchip/PYu-RC_Group_51_RoHS_L_12.pdf
U3 = IC-BUCK-0001: IC REG BUCK ADJ 5A 10WSON; ComponentLink1Description: Datasheet; ComponentLink1URL: https://www.ti.com/general/docs/suppproductinfo.tsp?distId=10&gotoUrl=https%3A%2F%2Fwww.ti.com%2Flit%2Fgpn%2Ftps54561

## Sheet Headers.SchDoc
size A; SheetNumber: 6; SheetTotal: 7
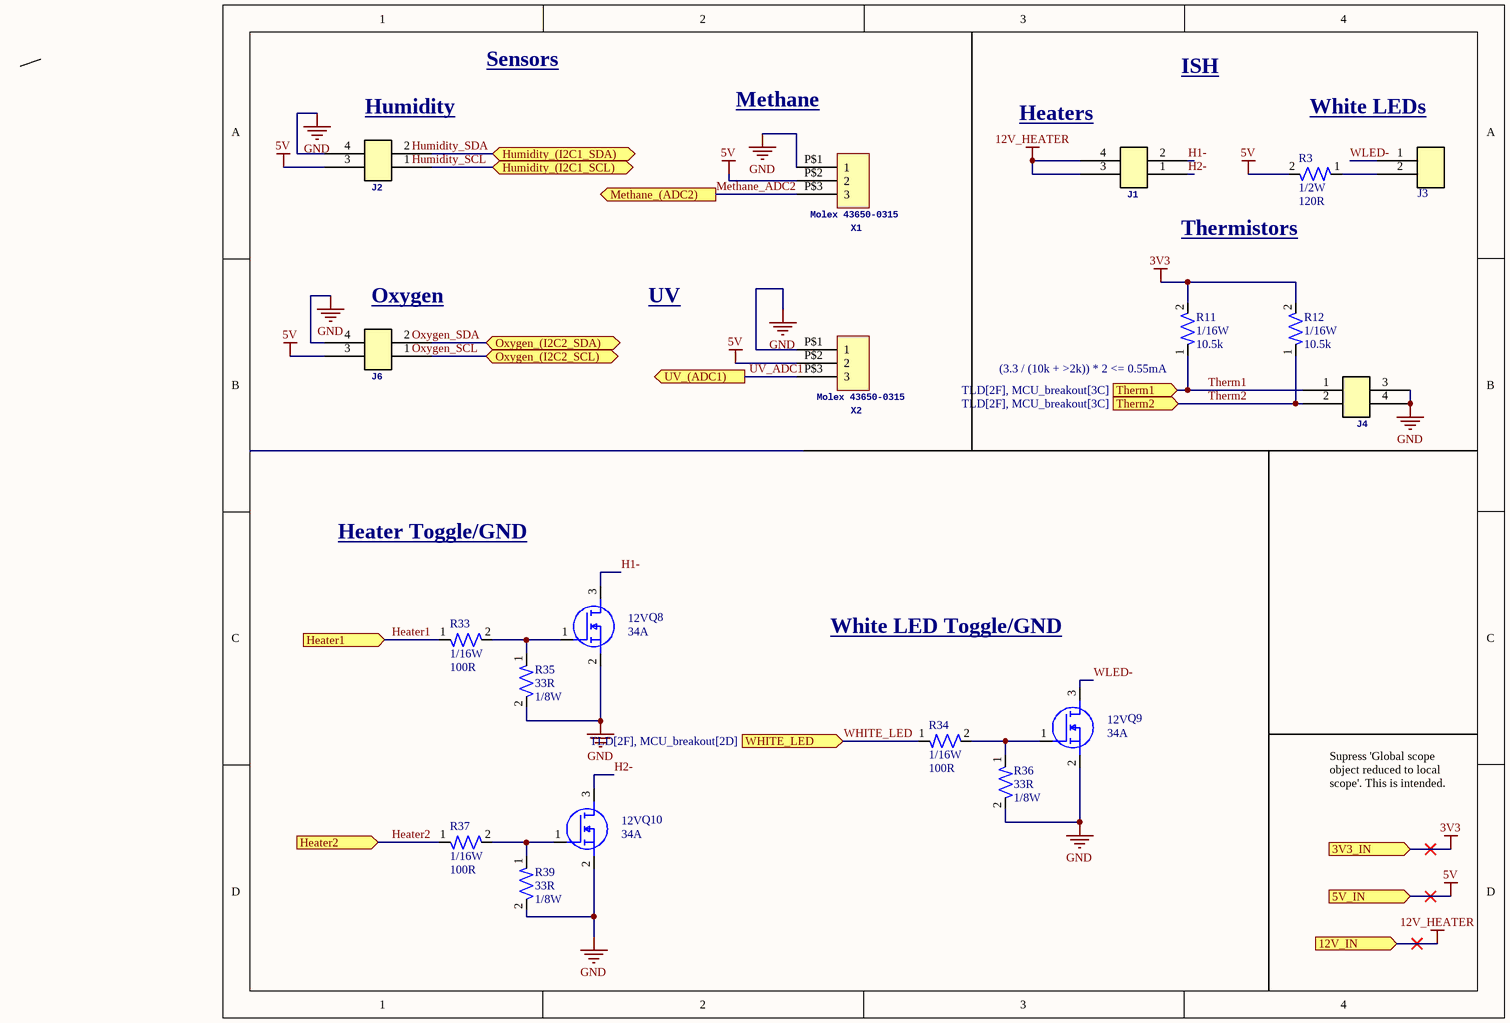
[diagram p4: Headers.SchDoc]

### Parts
J1  Molex 43045-0412  [CONN-4POS-0002]  (value not drawn)
J2  Molex 43045-0412  [CONN-4POS-0002]  (value not drawn)
J3  0430450212  [CONN-2POS-0001]  (value not drawn)
J4  Molex 43045-0412  [CONN-4POS-0002]  (value not drawn)
J6  Molex 43045-0412  [CONN-4POS-0002]  (value not drawn)
Q8  SI4838BDY-T1-GE3  [SOIC8_NARROW_VIS]  (value not drawn)
Q9  SI4838BDY-T1-GE3  [SOIC8_NARROW_VIS]  (value not drawn)
Q10  SI4838BDY-T1-GE3  [SOIC8_NARROW_VIS]  (value not drawn)
R3  Power: 1/2W  Resistance: 120R  [RES-1210]  (hidden comment: RC1210FR-07120RL)
R11  Power: 1/16W  Resistance: 10.5k  [RES-0402]  (hidden comment: RC0402FR-0710K5L)
R12  Power: 1/16W  Resistance: 10.5k  [RES-0402]  (hidden comment: RC0402FR-0710K5L)
R33  Power: 1/16W  Resistance: 100R  [RES-0402]  (hidden comment: RC0402FR-07100RL)
R34  Power: 1/16W  Resistance: 100R  [RES-0402]  (hidden comment: RC0402FR-07100RL)
R35  Resistance: 33R  Power: 1/8W  [RES-0402]  (hidden comment: RC0402FR-7W33RL)
R36  Resistance: 33R  Power: 1/8W  [RES-0402]  (hidden comment: RC0402FR-7W33RL)
R37  Power: 1/16W  Resistance: 100R  [RES-0402]  (hidden comment: RC0402FR-07100RL)
R39  Resistance: 33R  Power: 1/8W  [RES-0402]  (hidden comment: RC0402FR-7W33RL)
X1  Molex 43650-0315  [43650-0315]
X2  Molex 43650-0315  [43650-0315]

### Ports
3V3_IN (in), 5V_IN (in), 12V_IN (in), Heater1 (in, see TLD[3G], MCU_breakout[1C]), Heater2 (in, see TLD[3G], MCU_breakout[1C]), Humidity_(I2C1_SCL) (bidir, see TLD[2G]), Humidity_(I2C1_SDA) (bidir, see TLD[2G]), Methane_(ADC2) (out, see TLD[2G]), Oxygen_(I2C2_SCL) (bidir, see TLD[2F]), Oxygen_(I2C2_SDA) (bidir, see TLD[2F]), Therm1 (in, see TLD[2F], MCU_breakout[3C]), Therm2 (in, see TLD[2F], MCU_breakout[3C]), UV_(ADC1) (out, see TLD[2F]), WHITE_LED (in, see TLD[2F], MCU_breakout[2D])

### Nets
3V3: R11.2 R12.2 ; port 3V3_IN  [project net 3V3_OUT]
5V: J2.3 J6.3 R3.2 X1.P$2(2) X2.P$2(2) ; port 5V_IN  [project net 5V_OUT]
12V_HEATER: J1.3 J1.4 ; port 12V_IN
GND: J2.4 J4.3 J4.4 J6.4 Q8.2(S) Q9.2(S) Q10.2(S) R35.2 R36.2 R39.2 X1.P$1(1) X2.P$1(1)
H1-: J1.2 Q8.3(D)
H2-: J1.1 Q10.3(D)
Heater1: R33.1 ; port Heater1
Heater2: R37.1 ; port Heater2
Humidity (I2C3_SCL): J2.1 ; port Humidity_(I2C1_SCL)
Humidity_SDA: J2.2 ; port Humidity_(I2C1_SDA)
Methane_ADC2: X1.P$3(3) ; port Methane_(ADC2)  [project net Methane (ADC2)]
Oxygen (I2C2_SCL): J6.1 ; port Oxygen_(I2C2_SCL)
Oxygen (I2C2_SDA): J6.2 ; port Oxygen_(I2C2_SDA)
Therm1: J4.1 R11.1 ; port Therm1
Therm2: J4.2 R12.1 ; port Therm2  [project net Therm1]
UV_ADC1: X2.P$3(3) ; port UV_(ADC1)  [project net UV (ADC1)]
WHITE_LED: R34.1 ; port WHITE_LED
WLED-: J3.1 Q9.3(D)
NetJ3_2: J3.2 R3.1
NetQ8_1: Q8.1(G) R33.2 R35.1
NetQ9_1: Q9.1(G) R34.2 R36.1
NetQ10_1: Q10.1(G) R37.2 R39.1

### Notes on the sheet
- Sensors
- ISH
- (near J2) Humidity
- Methane
- (near J1) Heaters
- White LEDs
- Thermistors
- (near J6) Oxygen
- UV
- (near R11) (3.3 / (10k + >2k)) * 2 <= 0.55mA
- Heater Toggle/GND
- White LED Toggle/GND
- Supress 'Global scope object reduced to local scope'. This is intended.
- Labels drawn without touching a wire or pin: Humidity_SCL, Humidity_SDA, Oxygen_SCL, Oxygen_SDA
- (in symbol NMOS-34A-0001) 12V; 34A

### Library data of the parts
J1 J2 J4 J6 = CONN-4POS-0002: CONN HEADER VERT 4POS 3MM; ComponentLink1Description: Datasheet; ComponentLink1URL: https://www.molex.com/content/dam/molex/molex-dot-com/products/automated/en-us/salesdrawingpdf/430/43045/430450412_sd.pdf?inline
J3 = CONN-2POS-0001: CONN HEADER VERT 2POS; ComponentLink1Description: Datasheet; ComponentLink1URL: https://tools.molex.com/pdm_docs/ps/PS-43045.pdf
Q8-Q10 = NMOS-34A-0001: MOSFET N-CH 12 V 34A (Tc) 2.5W (Ta), 5.7W (Tc) Surface Mount 8-SOIC; Mfr_Name: Vishay; RefDes: RefDes; Type: Type
R3 = RES-120-0001: RES 120 OHM 1% 1/2W 1210; Tolerance: 1%; Size: 1210; ComponentLink1Description: Datasheet; ComponentLink1URL: https://www.yageo.com/upload/media/product/products/datasheet/rchip/PYu-RC_Group_51_RoHS_L_12.pdf
R11 R12 = RES-10.5k-0001: RES 10.5K OHM 1% 1/16W 0402; Tolerance: 1%; Size: 0402; ComponentLink1Description: Datasheet; ComponentLink1URL: https://www.yageo.com/upload/media/product/products/datasheet/rchip/PYu-RC_Group_51_RoHS_L_12.pdf
R33 R34 R37 = RES-100-0001: RES 100 OHM 1% 1/16W 0402; Tolerance: 1%; Size: 0402; ComponentLink1Description: Datasheet; ComponentLink1URL: https://www.yageo.com/upload/media/product/products/datasheet/rchip/PYu-RC_Group_51_RoHS_L_12.pdf
R35 R36 R39 = RES-33-0001: RES 33 OHM 1% 1/8W 0402; Tolerance: 1%; Size: 0402; ComponentLink1Description: Datasheet; ComponentLink1URL: https://www.yageo.com/upload/media/product/products/datasheet/rchip/PYu-RC_Group_51_RoHS_L_12.pdf
X1 X2 = Micro-Fit Molex 3 Pin Vertical: as X3 on sheet CAN_Transceiver; DeviceName: 43650-0315; LibraryName: con-molex-micro-fit-3_0_2; Package: 43650-0315

## Sheet MCU_breakout.SchDoc
size A; SheetNumber: 2; SheetTotal: 7
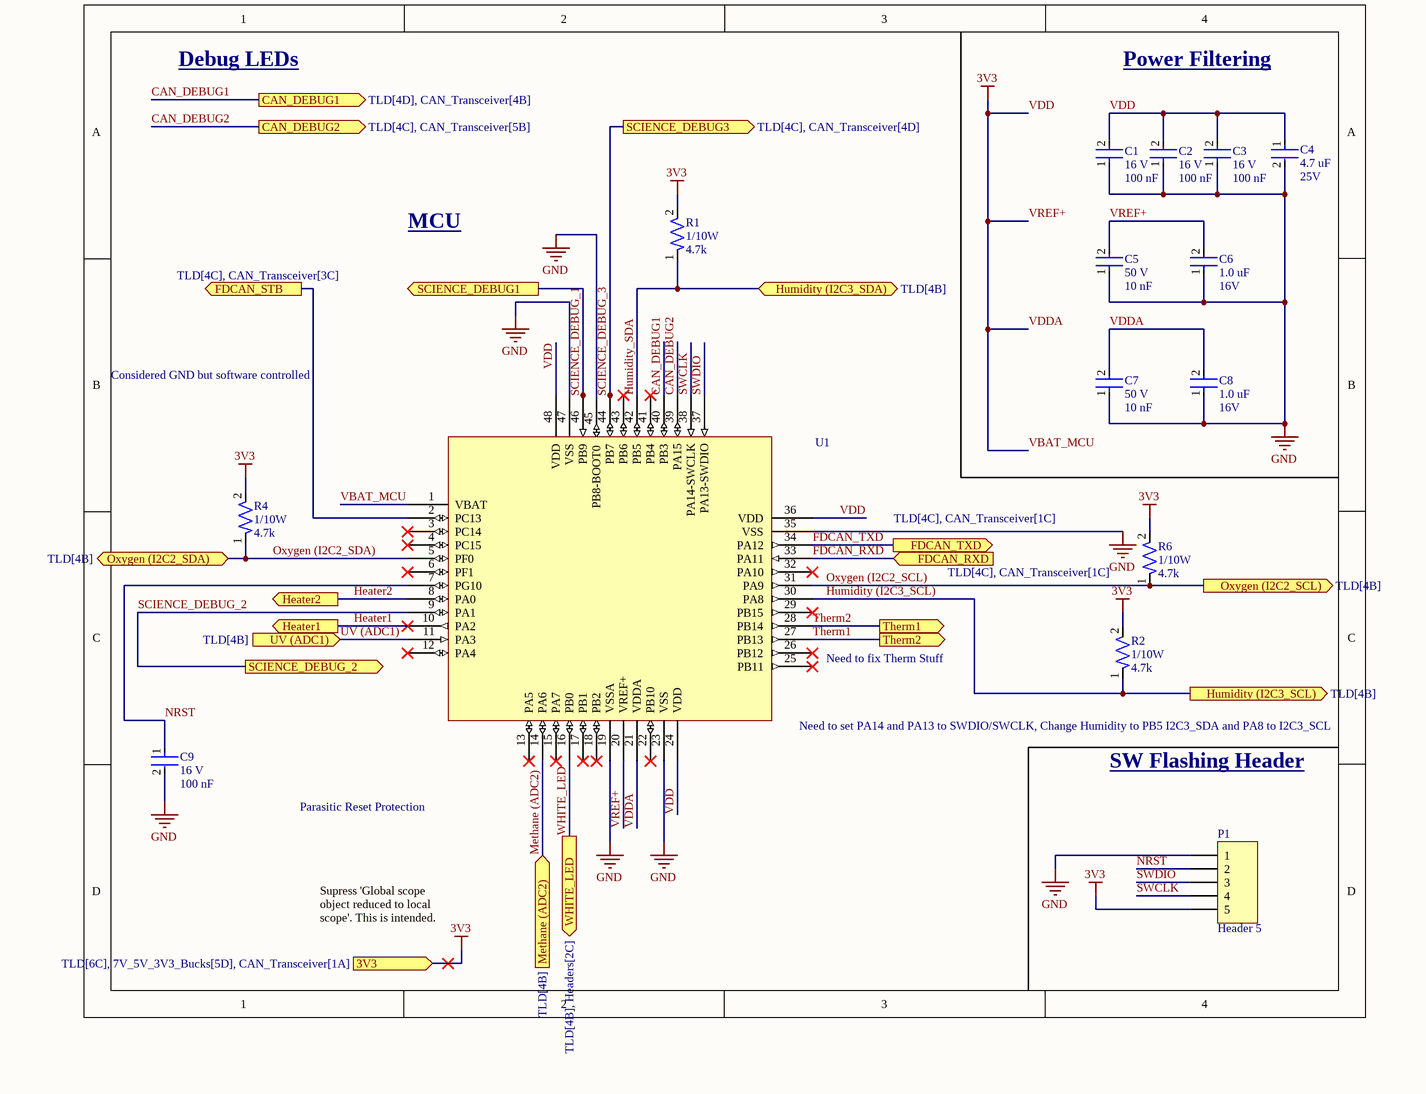
[diagram p5: MCU_breakout.SchDoc]

### Parts
C1  Voltage Rating: 16 V  Capacitance: 100 nF  [CAP-0402]  (hidden comment: CC0402KRX7R7BB104)
C2  Voltage Rating: 16 V  Capacitance: 100 nF  [CAP-0402]  (hidden comment: CC0402KRX7R7BB104)
C3  Voltage Rating: 16 V  Capacitance: 100 nF  [CAP-0402]  (hidden comment: CC0402KRX7R7BB104)
C4  Capacitance: 4.7 uF  Voltage: 25V  [CAP-0603]  (hidden comment: CC0603KRX5R8BB475)
C5  Voltage: 50 V  Capacitance: 10 nF  [CAP-0603]  (hidden comment: CC0603KPX7R9BB103)
C6  Capacitance: 1.0 uF  Voltage: 16V  [CAP-0603]  (hidden comment: CC0603KRX7R7BB105)
C7  Voltage: 50 V  Capacitance: 10 nF  [CAP-0603]  (hidden comment: CC0603KPX7R9BB103)
C8  Capacitance: 1.0 uF  Voltage: 16V  [CAP-0603]  (hidden comment: CC0603KRX7R7BB105)
C9  Voltage Rating: 16 V  Capacitance: 100 nF  [CAP-0402]  (hidden comment: CC0402KRX7R7BB104)
P1  Header 5  [HDR1X5]
R1  Power: 1/10W  Resistance: 4.7k  [RES-0603]  (hidden comment: RC0603FR-074K7L)
R2  Power: 1/10W  Resistance: 4.7k  [RES-0603]  (hidden comment: RC0603FR-074K7L)
R4  Power: 1/10W  Resistance: 4.7k  [RES-0603]  (hidden comment: RC0603FR-074K7L)
R6  Power: 1/10W  Resistance: 4.7k  [RES-0603]  (hidden comment: RC0603FR-074K7L)
U1  STM32G431CBT6  [IC-LQFP48]  (value not drawn)

### Ports
3V3 (in, see TLD[6C], 7V_5V_3V3_Bucks[5D], CAN_Transceiver[1A]), CAN_DEBUG1 (out, see TLD[4D], CAN_Transceiver[4B]), CAN_DEBUG2 (out, see TLD[4C], CAN_Transceiver[5B]), FDCAN_RXD (in, see TLD[4C], CAN_Transceiver[1C]), FDCAN_STB (out), FDCAN_TXD (out, see TLD[4C], CAN_Transceiver[1C]), Heater1 (out, see TLD[4D], Headers[1C]), Heater2 (out, see TLD[4D], Headers[1D]), Humidity (I2C3_SCL) (out, see TLD[4B]), Humidity (I2C3_SDA) (bidir, see TLD[4B]), Methane (ADC2) (in, see TLD[4B]), Oxygen (I2C2_SCL) (out, see TLD[4B]), Oxygen (I2C2_SDA) (bidir, see TLD[4B]), SCIENCE_DEBUG1 (out, see TLD[4C], CAN_Transceiver[3C]), SCIENCE_DEBUG3 (out, see TLD[4C], CAN_Transceiver[4D]), SCIENCE_DEBUG_2 (out), Therm1 (out, see TLD[4B], Headers[3B]), Therm2 (out, see TLD[4B], Headers[3B]), UV (ADC1) (in, see TLD[4B]), WHITE_LED (out, see TLD[4B], Headers[2C])

### Nets
3V3: C1.2 C2.2 C3.2 C4.1 C5.2 C6.2 C7.2 C8.2 P1.5 R1.2 R2.2 R4.2 R6.2 U1.1(VBAT) U1.20(VREF+) U1.21(VDDA) U1.24(VDD) U1.36(VDD) U1.48(VDD) ; port 3V3  [also labelled VBAT_MCU, VDD, VDDA, VREF+]  [project net 3V3_OUT]
GND: C1.1 C2.1 C3.1 C4.2 C5.1 C6.1 C7.1 C8.1 C9.2 P1.1 U1.19(VSSA) U1.23(VSS) U1.35(VSS) U1.45(PB8-BOOT0) U1.47(VSS)
CAN_DEBUG1: U1.40(PB3) ; port CAN_DEBUG1
CAN_DEBUG2: U1.39(PA15) ; port CAN_DEBUG2
FDCAN_RXD: U1.33(PA11) ; port FDCAN_RXD
FDCAN_TXD: U1.34(PA12) ; port FDCAN_TXD
Heater1: U1.10(PA2) ; port Heater1
Heater2: U1.8(PA0) ; port Heater2
Humidity (I2C3_SCL): R2.1 U1.30(PA8) ; port Humidity (I2C3_SCL)
Humidity_SDA: R1.1 U1.42(PB5) ; port Humidity (I2C3_SDA)
Methane (ADC2): U1.14(PA6) ; port Methane (ADC2)
NRST: C9.1 P1.2 U1.7(PG10)
Oxygen (I2C2_SCL): R6.1 U1.31(PA9) ; port Oxygen (I2C2_SCL)
Oxygen (I2C2_SDA): R4.1 U1.5(PF0) ; port Oxygen (I2C2_SDA)
SCIENCE_DEBUG_1: U1.46(PB9) ; port SCIENCE_DEBUG1  [project net SCIENCE_DEBUG1]
SCIENCE_DEBUG_2: U1.9(PA1) ; port SCIENCE_DEBUG_2
SCIENCE_DEBUG_3: U1.44(PB7) ; port SCIENCE_DEBUG3  [project net SCIENCE_DEBUG3]
SWCLK: P1.4 U1.38(PA14-SWCLK)
SWDIO: P1.3 U1.37(PA13-SWDIO)
Therm1: U1.27(PB13) ; port Therm2
Therm2: U1.28(PB14) ; port Therm1  [project net Therm1]
UV (ADC1): U1.11(PA3) ; port UV (ADC1)
WHITE_LED: U1.16(PB0) ; port WHITE_LED
NetU1_2: U1.2(PC13) ; port FDCAN_STB

Not connected (* = marked no-connect by the designer): U1 3(PC14)* 4(PC15)* 6(PF1)* 12(PA4)* 13(PA5)* 15(PA7)* 17(PB1)* 18(PB2)* 22(PB10)* 25(PB11)* 26(PB12)* 29(PB15)* 32(PA10)* 41(PB4)* 43(PB6)*

### Notes on the sheet
- Debug LEDs
- Power Filtering
- MCU
- Considered GND but software controlled
- Need to fix Therm Stuff
- (near U1) Need to set PA14 and PA13 to SWDIO/SWCLK, Change Humidity to PB5 I2C3_SDA and PA8 to I2C3_SCL
- SW Flashing Header
- Parasitic Reset Protection
- Supress 'Global scope object reduced to local scope'. This is intended.

### Library data of the parts
C1-C3 C9 = CAP-0.1U-0001: CAP CER 0.1UF 16V X7R 0402; ComponentLink2Description: Datasheet; ComponentLink2URL: https://www.yageo.com/upload/media/product/productsearch/datasheet/mlcc/UPY-GPHC_X7R_6.3V-to-250V_24.pdf; Device Class: Ceramic; Size: 0402
C4 = CAP-4.7U-0001: CAP CER 4.7UF 25V X5R 0603; Device Class: Ceramic; Size: 0603
C5 C7 = CAP-10N-0002: CAP CER 10000PF 50V X7R 0603; ComponentLink2Description: Datasheet; ComponentLink2URL: http://www.yageo.com/documents/recent/UPY-GPHC_X7R_6.3V-to-50V_18.pdf; Device Class: Ceramic; Size: 0603
C6 C8 = CAP-1U-0002: CAP CER 1UF 16V X7R 0603; Device Class: Ceramic; Size: 0603
P1 = Header 5: Header, 5-Pin; LatestRevisionDate: 17-Jul-2002; LatestRevisionNote: Re-released for DXP Platform.; Publisher: Altium Limited
R1 R2 R4 R6 = RES-4.7k-0001: RES 4.7K OHM 1% 1/10W 0603; Tolerance: 1%; Size: 0603; ComponentLink1Description: Datasheet; ComponentLink1URL: https://www.yageo.com/upload/media/product/products/datasheet/rchip/PYu-RC_Group_51_RoHS_L_12.pdf
U1 = IC-STM32G431CBT6: IC MCU 32BIT 128KB FLASH 48LQFP; Package: 48LQFP; ComponentLink1Description: Datasheet; ComponentLink1URL: https://www.st.com/resource/en/datasheet/stm32g431cb.pdf

## Sheet Input_Power.SchDoc
size A; SheetNumber: 7; SheetTotal: 7
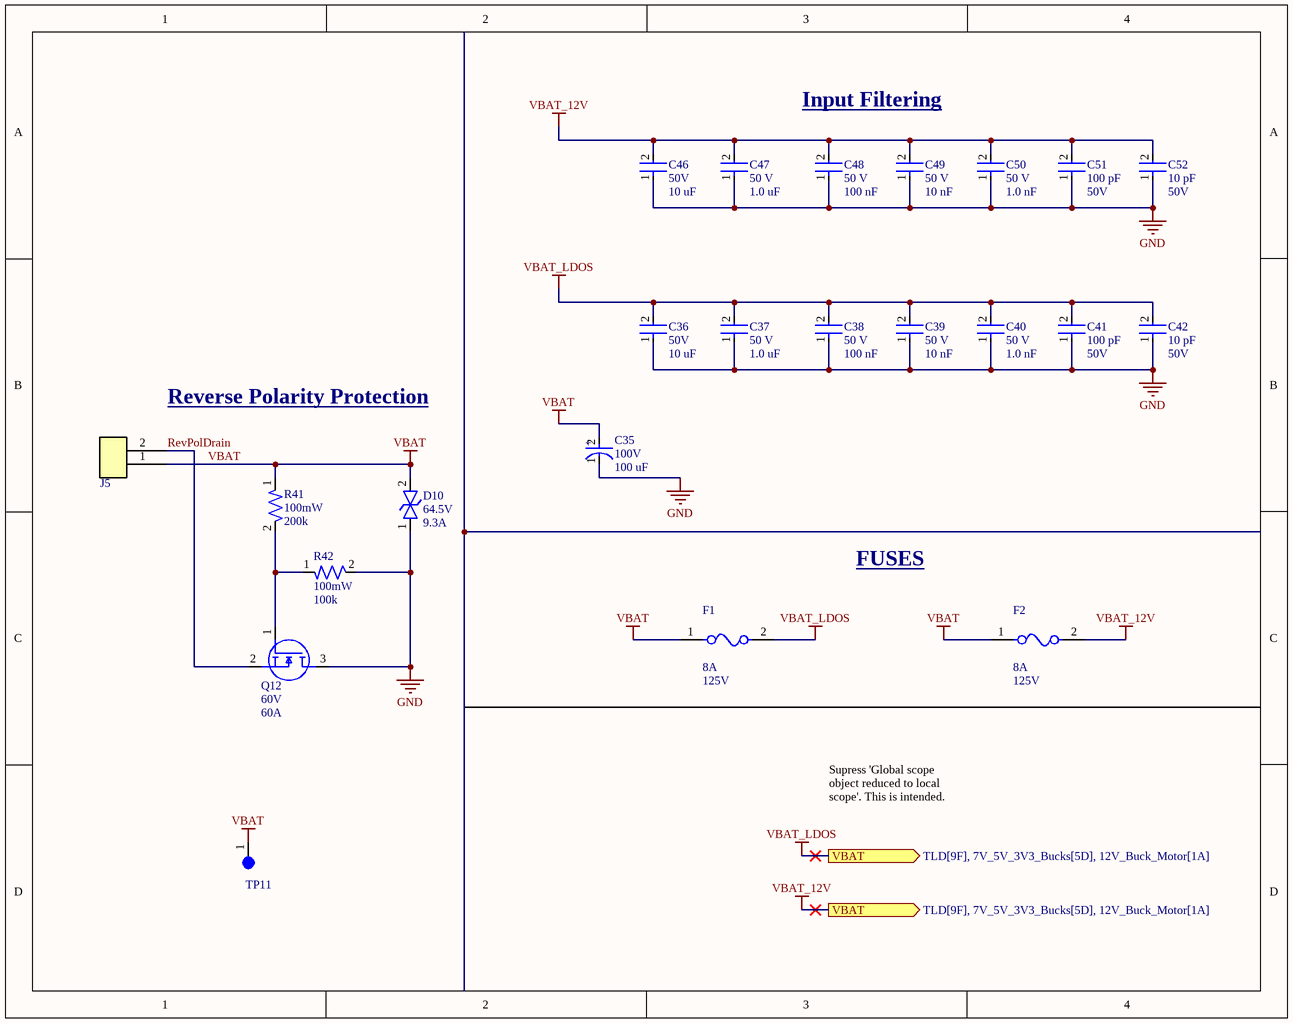
[diagram p6: Input_Power.SchDoc]

### Parts
C35  Voltage: 100V  Capacitance: 100 uF  [ELEC-100U-0001]  (hidden comment: 100SEV100M12.5X16)
C36  Voltage: 50V  Capacitance: 10 uF  [CAP-1210]  (hidden comment: CL32B106KBJNNNE)
C37  Voltage: 50 V  Capacitance: 1.0 uF  [CAP-0805]  (hidden comment: CC0805KKX7R9BB105)
C38  Voltage Rating: 50 V  Capacitance: 100 nF  [CAP-0805]  (hidden comment: CC0805KRX7R9BB104)
C39  Voltage: 50 V  Capacitance: 10 nF  [CAP-0603]  (hidden comment: CC0603KPX7R9BB103)
C40  Voltage: 50 V  Capacitance: 1.0 nF  [CAP-0402]  (hidden comment: CC0402KRX7R9BB102)
C41  Capacitance: 100 pF  Voltage: 50V  [CAP-0402]  (hidden comment: CC0402JRNPO9BN101)
C42  Capacitance: 10 pF  Voltage: 50V  [CAP-0402]  (hidden comment: CC0402JRNPO9BN100)
C46  Voltage: 50V  Capacitance: 10 uF  [CAP-1210]  (hidden comment: CL32B106KBJNNNE)
C47  Voltage: 50 V  Capacitance: 1.0 uF  [CAP-0805]  (hidden comment: CC0805KKX7R9BB105)
C48  Voltage Rating: 50 V  Capacitance: 100 nF  [CAP-0805]  (hidden comment: CC0805KRX7R9BB104)
C49  Voltage: 50 V  Capacitance: 10 nF  [CAP-0603]  (hidden comment: CC0603KPX7R9BB103)
C50  Voltage: 50 V  Capacitance: 1.0 nF  [CAP-0402]  (hidden comment: CC0402KRX7R9BB102)
C51  Capacitance: 100 pF  Voltage: 50V  [CAP-0402]  (hidden comment: CC0402JRNPO9BN101)
C52  Capacitance: 10 pF  Voltage: 50V  [CAP-0402]  (hidden comment: CC0402JRNPO9BN100)
D10  Voltage Rating: 64.5V  Current Rating: 9.3A  [DO-214AA (SMBJ)]  (hidden comment: SMBJ40CA)
F1  Fuse Current: 8A  Voltage Rating: 125V  [FUSE-0001]  (hidden comment: 01550900M)
F2  Fuse Current: 8A  Voltage Rating: 125V  [FUSE-0001]  (hidden comment: 01550900M)
J5  0430450212  [CONN-2POS-0001]  (value not drawn)
Q12  Voltage: 60V  Continuous Current: 60A  [IC-8VSONCLIP]  (hidden comment: CSD18543Q3AT)
R41  Power: 100mW  Resistance: 200k  [RES-0603]  (hidden comment: RC0603FR-07200KL)
R42  Power: 100mW  Resistance: 100k  [RES-0603]  (hidden comment: RC0603FR-07100KL)
TP11  5003  [TEST-POINT-0001]  (value not drawn)

### Ports
VBAT (out, see TLD[9F], 7V_5V_3V3_Bucks[5D], 12V_Buck_Motor[1A])

### Nets
GND: C35.1 C36.1 C37.1 C38.1 C39.1 C40.1 C41.1 C42.1 C46.1 C47.1 C48.1 C49.1 C50.1 C51.1 C52.1 D10.1 Q12.3(D) R42.2
VBAT: C35.2 D10.2 F1.1 F2.1 J5.1 R41.1 TP11.1
VBAT_12V: C36.2 C37.2 C38.2 C39.2 C40.2 C41.2 C42.2 C46.2 C47.2 C48.2 C49.2 C50.2 C51.2 C52.2 F1.2 F2.2 ; port VBAT  [also labelled VBAT_LDOS]
RevPolDrain: J5.2 Q12.2(S)
NetQ12_1: Q12.1(G) R41.2 R42.1

### Notes on the sheet
- Input Filtering
- Reverse Polarity Protection
- FUSES
- Supress 'Global scope object reduced to local scope'. This is intended.
- (in symbol CAP-100U-0002) +

### Library data of the parts
C35 = CAP-100U-0002: 100 µF 100 V Aluminum Electrolytic Capacitors Radial, Can - SMD 2000 Hrs @ 85°C; Device Class: Electrolytic; ComponentLink1Description: Datasheet; ComponentLink1URL: https://industrial.panasonic.com/cdbs/www-data/pdf/RDE0000/ABA0000C1190.pdf
C36 C46 = CAP-10U-0002: CAP CER 10UF 50V X7R 1210; Device Class: Ceramic; Size: 1210; ComponentLink1Description: Datasheet; ComponentLink1URL: https://mm.digikey.com/Volume0/opasdata/d220001/medias/docus/41/CL32B106KBJNNNE_Spec.pdf
C37 C47 = CAP-1U-0001: CAP CER 1UF 50V X7R 0805; ComponentLink2URL: https://www.yageo.com/upload/media/product/productsearch/datasheet/mlcc/UPY-GPHC_X7R_6.3V-to-250V_24.pdf; ComponentLink2Description: Datasheet; Device Class: Ceramic; Size: 0805
C38 C48 = CAP-0.1U-0002: CAP CER 0.1UF 50V X7R 0805; ComponentLink2Description: Datasheet; ComponentLink2URL: https://www.yageo.com/upload/media/product/productsearch/datasheet/mlcc/UPY-GPHC_X7R_6.3V-to-250V_24.pdf; Device Class: Ceramic; Size: 0805
C39 C49 = CAP-10N-0002: CAP CER 10000PF 50V X7R 0603; ComponentLink2Description: Datasheet; ComponentLink2URL: http://www.yageo.com/documents/recent/UPY-GPHC_X7R_6.3V-to-50V_18.pdf; Device Class: Ceramic; Size: 0603
C40 C50 = CAP-1N-0001: CAP CER 1000PF 50V X7R 0402; ComponentLink2Description: Datasheet; ComponentLink2URL: http://www.yageo.com/documents/recent/UPY-GP_NP0_16V-to-50V_16.pdf; Device Class: Ceramic; Size: 0402
C41 C51 = CAP-100P-0001: CAP CER 100PF 50V C0G/NPO 0402; Device Class: Ceramic; Size: 0402; ComponentLink1Description: Datasheet; ComponentLink1URL: https://www.yageo.com/upload/media/product/productsearch/datasheet/mlcc/UPY-GP_NP0_16V-to-50V_18.pdf
C42 C52 = CAP-10P-0001: CAP CER 10PF 50V C0G/NPO 0402; Device Class: Ceramic; Size: 0402; ComponentLink1Description: Datasheet; ComponentLink1URL: https://www.yageo.com/upload/media/product/productsearch/datasheet/mlcc/UPY-GP_NP0_16V-to-50V_18.pdf
D10 = DIO-TVS-0001: TVS DIODE 40VWM 64.5VC DO214AA; ComponentLink1Description: Datasheet; ComponentLink1URL: https://www.littelfuse.com/media?resourcetype=datasheets&itemid=09a6ae9a-73cb-4ac4-acac-e6dab92ab953&filename=littelfuse_tvs_diode_smbj_datasheet.pdf
F1 F2 = FUSE-0001: FUSE BLOK CARTRIDGE 125V 10A SMD; ComponentLink2Description: Datasheet; ComponentLink2URL: https://www.littelfuse.com/~/media/electronics/datasheets/fuses/littelfuse_fuse_154_154t_154l_154tl_datasheet.pdf.pdf
J5 = CONN-2POS-0001: CONN HEADER VERT 2POS; ComponentLink1Description: Datasheet; ComponentLink1URL: https://tools.molex.com/pdm_docs/ps/PS-43045.pdf
Q12 = NMOS-60A-0001: MOSFET N-CH 60V 12A/60A 8VSON; ComponentLink2Description: Datasheet; ComponentLink2URL: http://www.ti.com/lit/ds/symlink/csd18543q3a.pdf
R41 = RES-200k-0001: RES SMD 200K OHM 1% 1/10W 0603; Tolerance: 1%; Size: 0603; ComponentLink1Description: Datasheet; ComponentLink1URL: https://www.yageo.com/upload/media/product/products/datasheet/rchip/PYu-RC_Group_51_RoHS_L_12.pdf
R42 = RES-100k-0001: RES SMD 100K OHM 1% 1/10W 0603; Tolerance: 1%; Size: 0603; ComponentLink1Description: Datasheet; ComponentLink1URL: https://www.yageo.com/upload/media/product/products/datasheet/rchip/PYu-RC_Group_51_RoHS_L_12.pdf
TP11 = TEST-POINT-0001: as TP1 on sheet 12V_Buck_Motor

## Nets that join several sheets
3V3_OUT: CAN_Transceiver (6 pins), 7V_5V_3V3_Bucks (7 pins), Headers (R11.2 R12.2), MCU_breakout (19 pins)
5V_OUT: 12V_Buck_Motor (R5.2 R18.2), CAN_Transceiver (U4.3), 7V_5V_3V3_Bucks (9 pins), Headers (5 pins)
12V_HEATER: 12V_Buck_Motor (C10.2 L1.2 R7.2 TP1.1), Headers (J1.3 J1.4)
GND: 12V_Buck_Motor (13 pins), CAN_Transceiver (8 pins), 7V_5V_3V3_Bucks (28 pins), Headers (12 pins), MCU_breakout (15 pins), Input_Power (18 pins)
VBAT_12V: 12V_Buck_Motor (C12.2 C13.2 R19.2 U2.2), 7V_5V_3V3_Bucks (C18.2 C25.2 R23.2 U3.2), Input_Power (16 pins)
CAN_DEBUG1: CAN_Transceiver (Q6.1), MCU_breakout (U1.40)
CAN_DEBUG2: CAN_Transceiver (Q7.1), MCU_breakout (U1.39)
FDCAN_RXD: CAN_Transceiver (U4.4), MCU_breakout (U1.33)
FDCAN_TXD: CAN_Transceiver (U4.1), MCU_breakout (U1.34)
Heater1: Headers (R33.1), MCU_breakout (U1.10)
Heater2: Headers (R37.1), MCU_breakout (U1.8)
Humidity (I2C3_SCL): Headers (J2.1), MCU_breakout (R2.1 U1.30)
Humidity_SDA: Headers (J2.2), MCU_breakout (R1.1 U1.42)
Methane (ADC2): Headers (X1.P$3), MCU_breakout (U1.14)
Oxygen (I2C2_SCL): Headers (J6.1), MCU_breakout (R6.1 U1.31)
Oxygen (I2C2_SDA): Headers (J6.2), MCU_breakout (R4.1 U1.5)
SCIENCE_DEBUG1: CAN_Transceiver (Q1.1), MCU_breakout (U1.46)
SCIENCE_DEBUG3: CAN_Transceiver (Q4.1), MCU_breakout (U1.44)
Therm1: Headers (J4.1 R11.1), MCU_breakout (U1.28)
Therm1: Headers (J4.2 R12.1), MCU_breakout (U1.27)
UV (ADC1): Headers (X2.P$3), MCU_breakout (U1.11)
WHITE_LED: Headers (R34.1), MCU_breakout (U1.16)